# EAGLE design Video_critter_v01 (EAGLE 6.1)
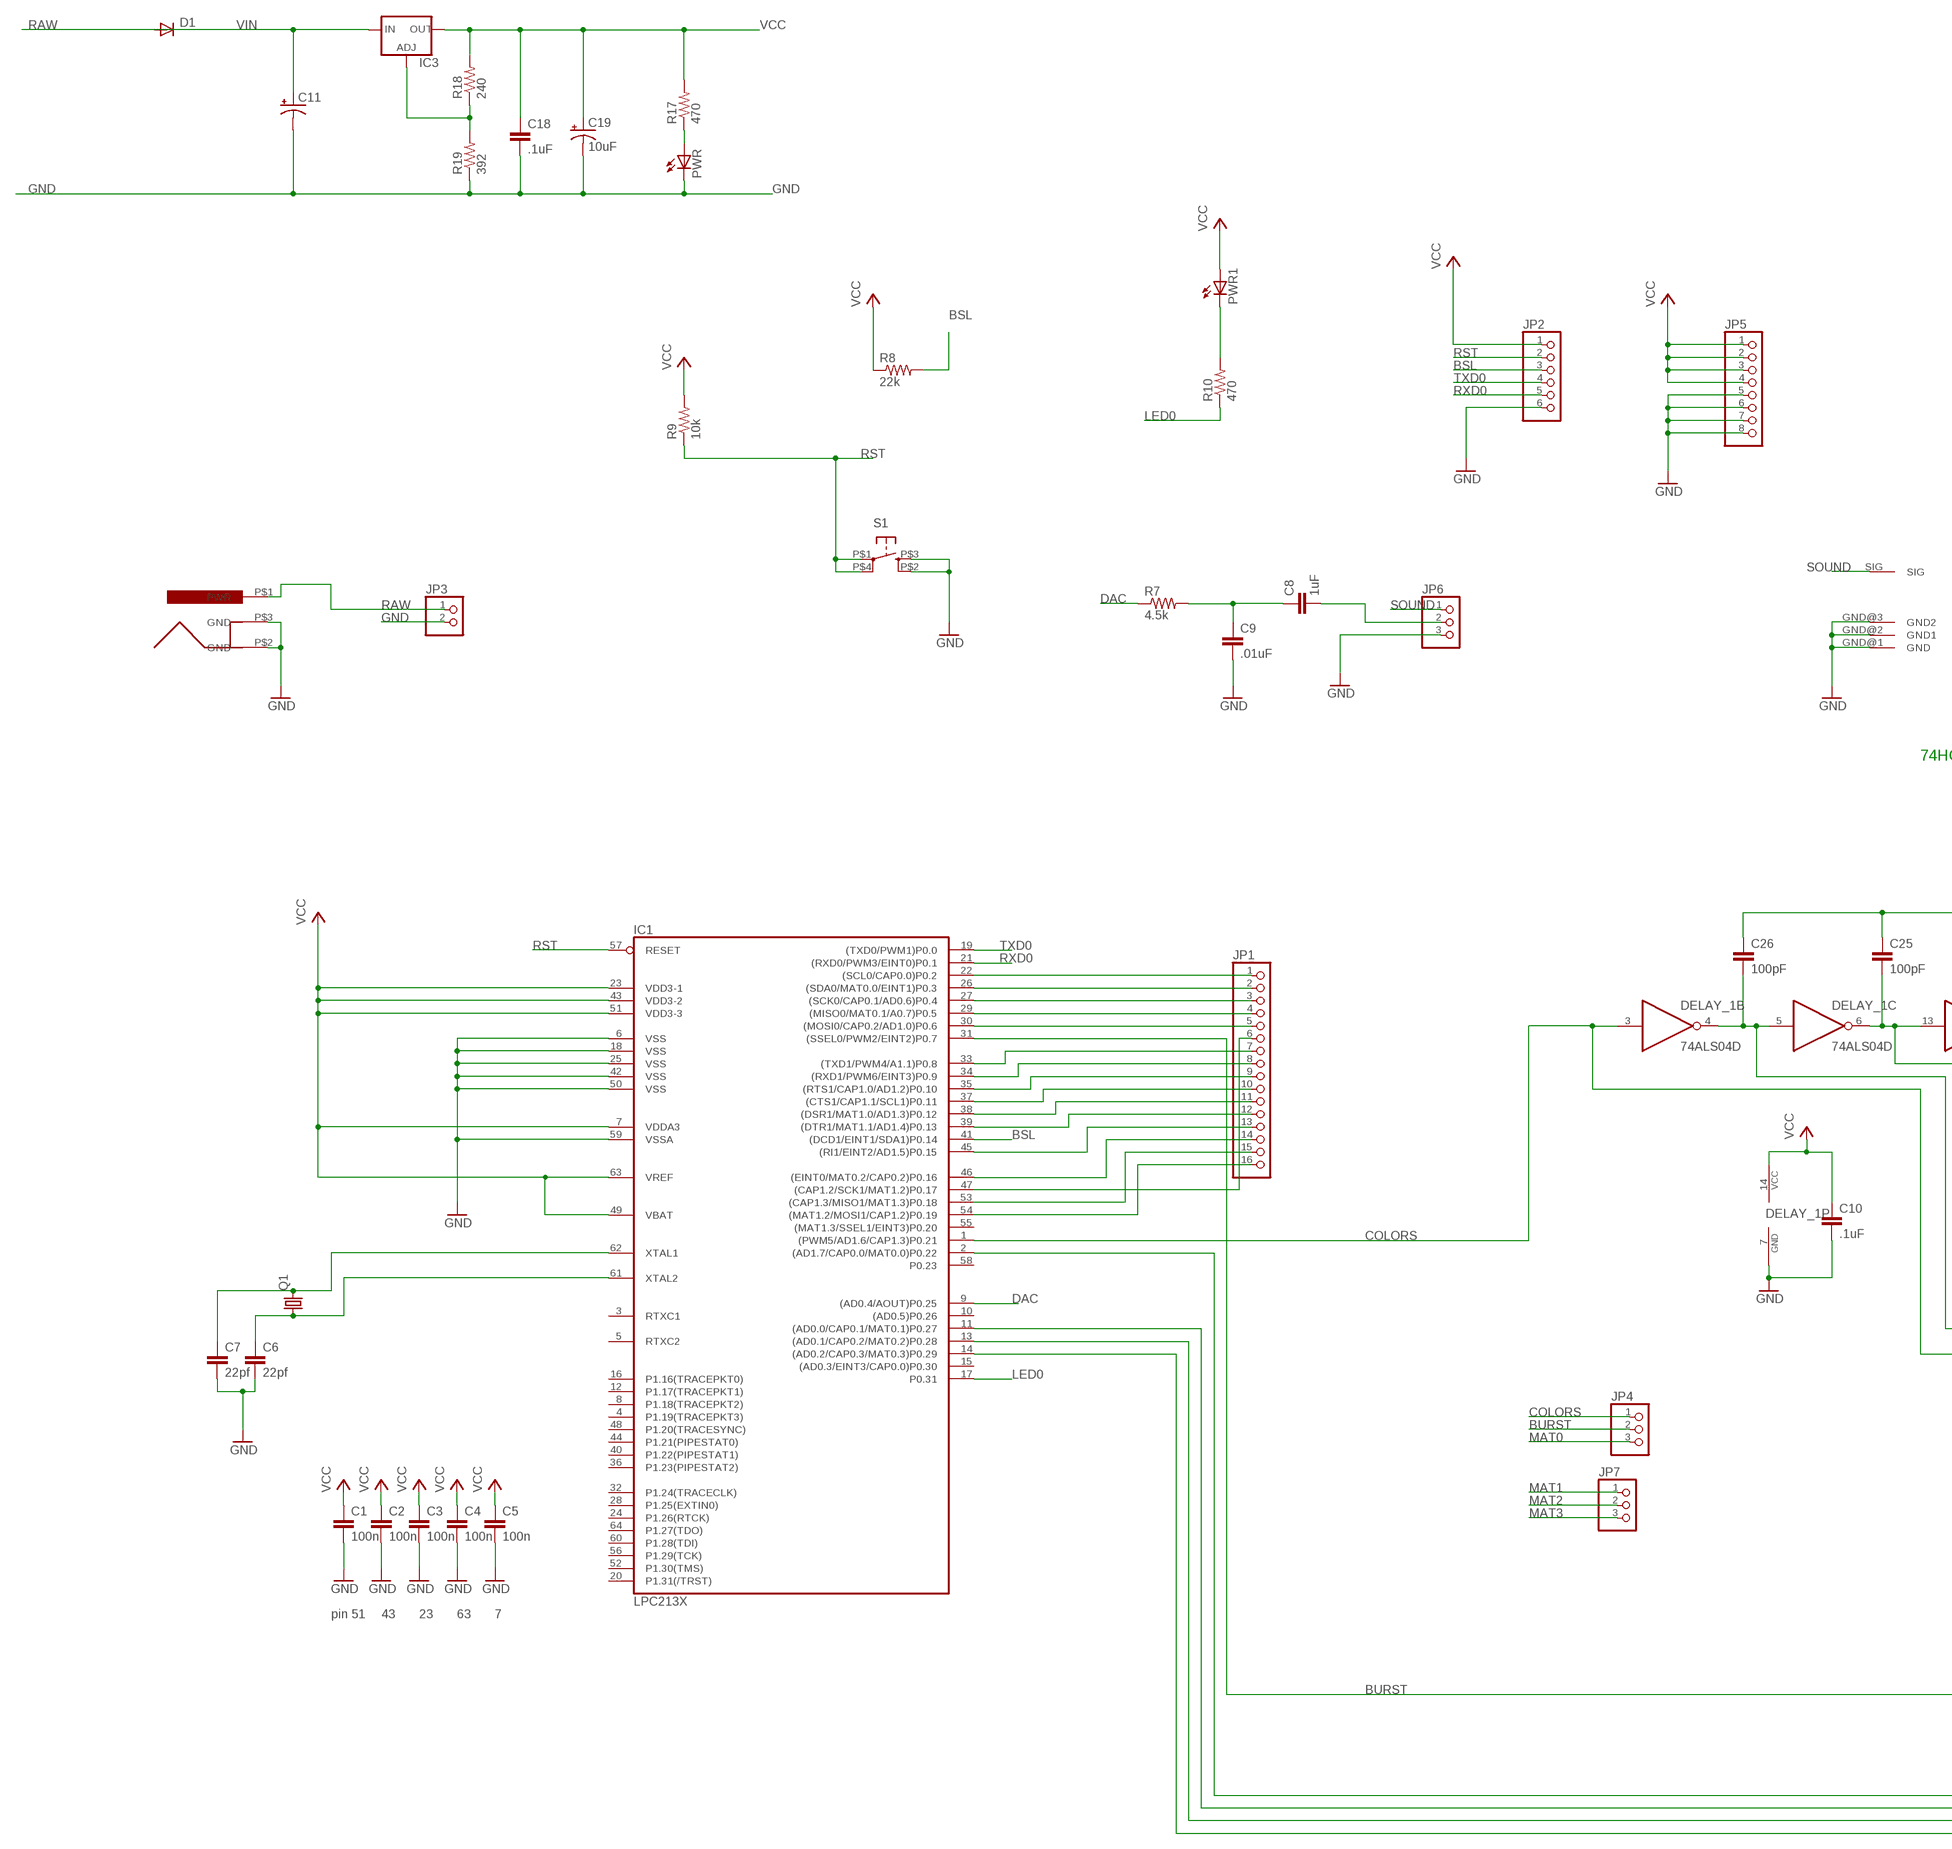
[diagram p0: schematic, sheet 1, part 1 of 2]
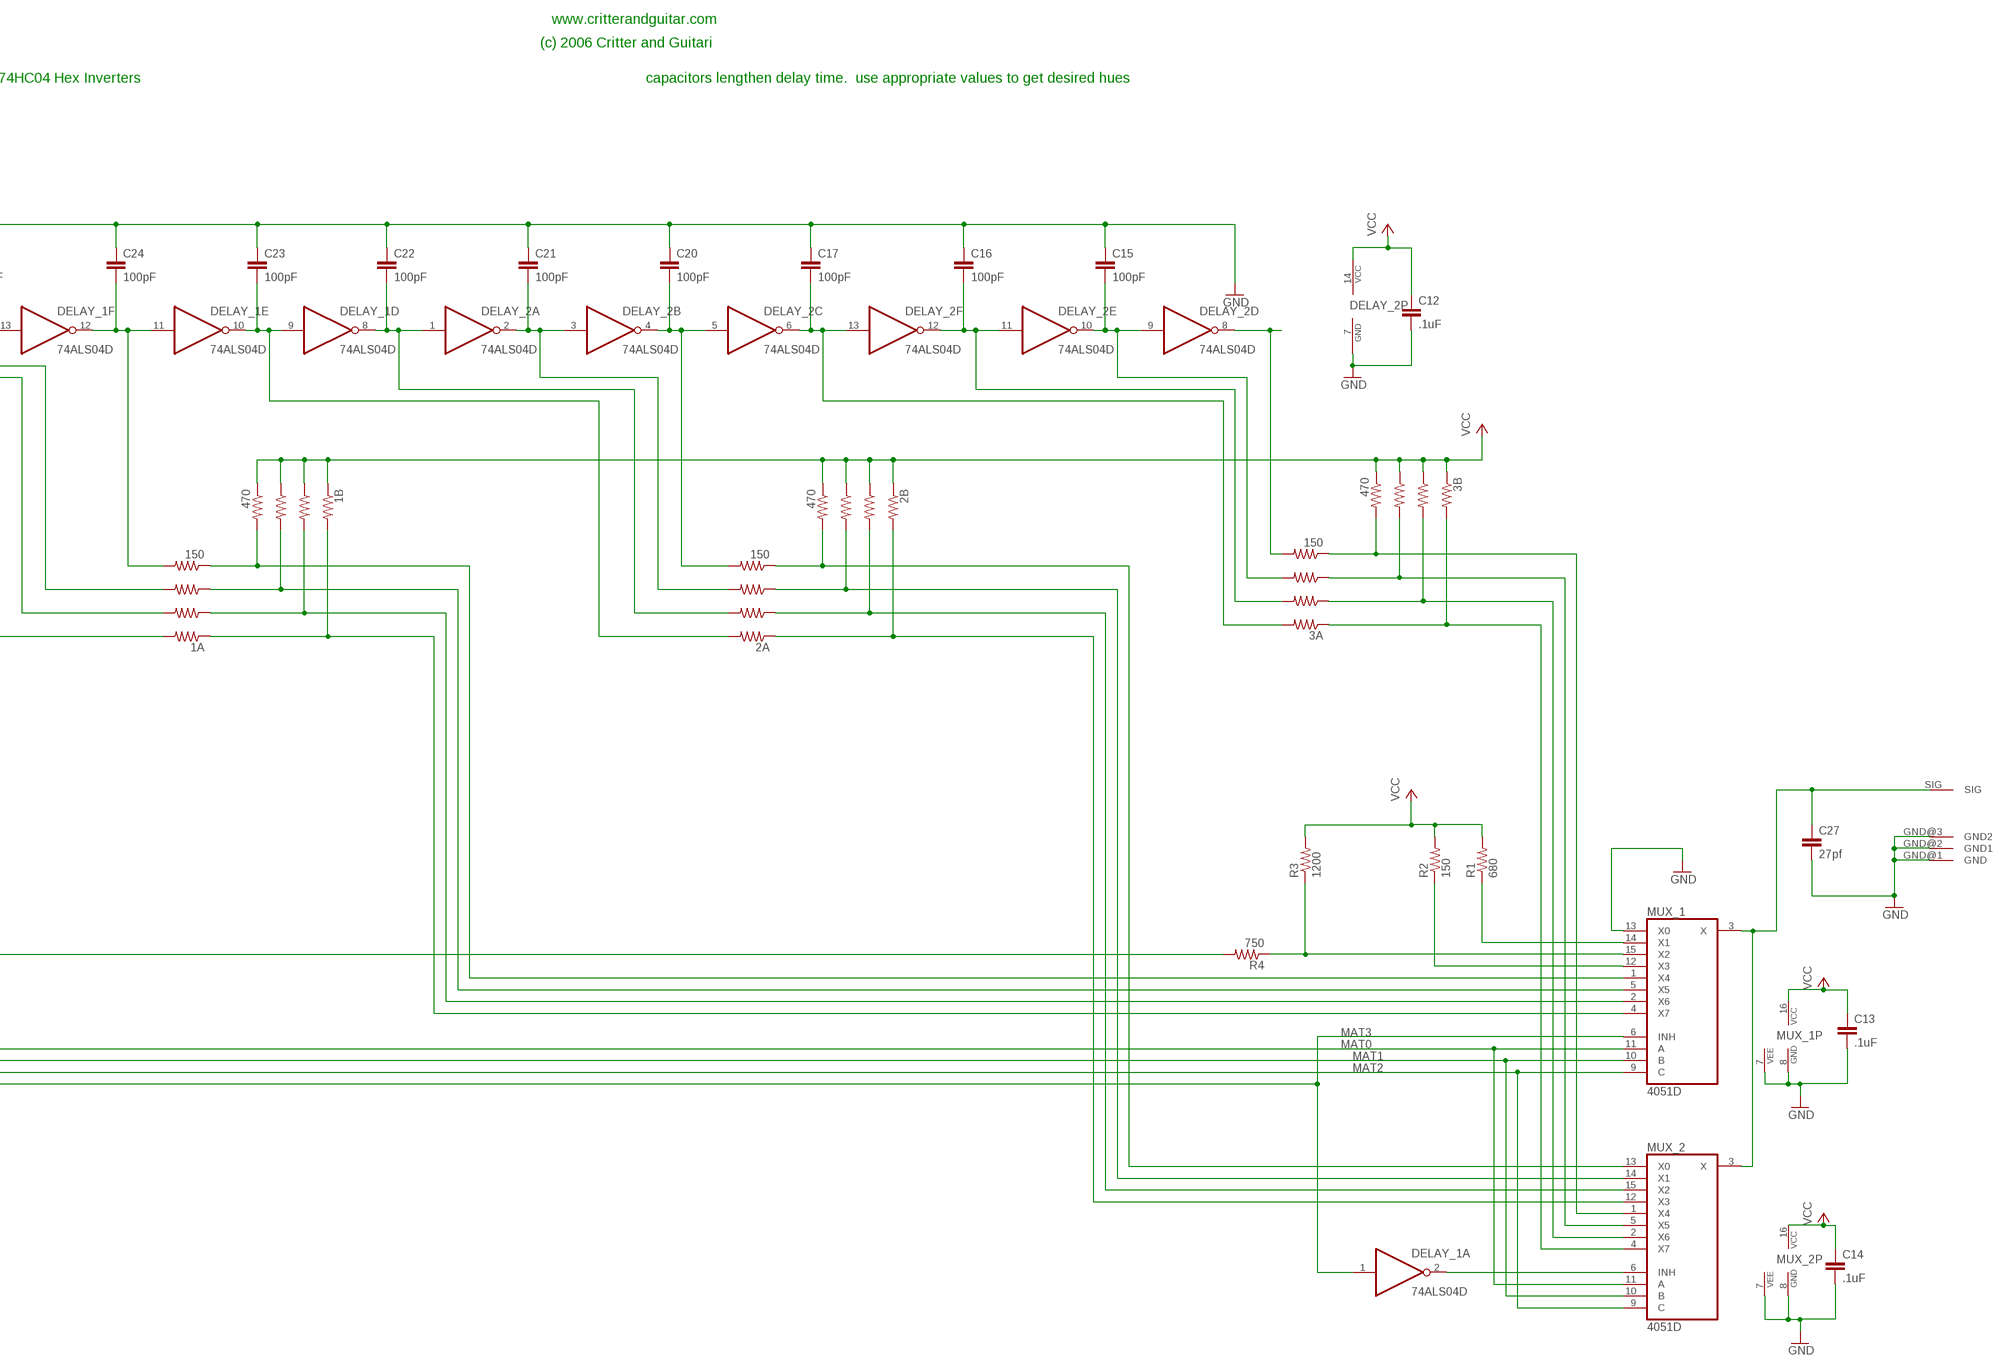
[diagram p1: schematic, sheet 1, part 2 of 2]

## Parts
1A  150  RESISTORX41206  [1206X4RESISTOR]
1B  470  RESISTORX41206  [1206X4RESISTOR]
2A  150  RESISTORX41206  [1206X4RESISTOR]
2B  470  RESISTORX41206  [1206X4RESISTOR]
3A  150  RESISTORX41206  [1206X4RESISTOR]
3B  470  RESISTORX41206  [1206X4RESISTOR]
C1  100n  CAP0603  [C0603]
C2  100n  CAP0603  [C0603]
C3  100n  CAP0603  [C0603]
C4  100n  CAP0603  [C0603]
C5  100n  CAP0603  [C0603]
C6  22pf  CAP0603  [C0603]
C7  22pf  CAP0603  [C0603]
C8  1uF  CAP0603  [C0603]
C9  .01uF  CAP0603  [C0603]
C10  .1uF  CAP0603  [C0603]
C11  CPOL-USE3.5-8  [E3,5-8]
C12  .1uF  CAP0603  [C0603]
C13  .1uF  CAP0603  [C0603]
C14  .1uF  CAP0603  [C0603]
C15  100pF  CAP0603  [C0603]
C16  100pF  CAP0603  [C0603]
C17  100pF  CAP0603  [C0603]
C18  .1uF  CAP0603  [C0603]
C19  10uF  CAP_POL1206  [CPOL_1206]
C20  100pF  CAP0603  [C0603]
C21  100pF  CAP0603  [C0603]
C22  100pF  CAP0603  [C0603]
C23  100pF  CAP0603  [C0603]
C24  100pF  CAP0603  [C0603]
C25  100pF  CAP0603  [C0603]
C26  100pF  CAP0603  [C0603]
C27  27pf  CAP0603  [C0603]
D1  DIODESMB  [SMB]
DELAY_1  74ALS04D  [SO14]
DELAY_2  74ALS04D  [SO14]
IC1  LPC213X  [SQFP-S-10X10-64]
IC3  V_REG_FAN1117SOT223  [SOT223]
JP1  PINHD-1X16  [1X16]
JP2  PINHD-1X6  [1X06]
JP3  PINHD-1X2  [1X02]
JP4  PINHD-1X3  [1X03]
JP5  PINHD-1X8  [1X08]
JP6  PINHD-1X3  [1X03]
JP7  PINHD-1X3  [1X03]
MUX_1  4051D  [SO16]
MUX_2  4051D  [SO16]
PWR  LED1206  [CHIPLED_1206]
PWR1  LED1206  [CHIPLED_1206]
Q1  CRYSTALSOCKETED  [HC49U-SOCKETED]
R1  680  RES0603  [R0603]
R2  150  RES0603  [R0603]
R3  1200  RES0603  [R0603]
R4  750  RES0603  [R0603]
R7  4.5k  RES0603  [R0603]
R8  22k  RES0603  [R0603]
R9  10k  RES0603  [R0603]
R10  470  RES0603  [R0603]
R17  470  RES0603  [R0603]
R18  240  RES0603  [R0603]
R19  392  RES0603  [R0603]
S1  TAC_SWITCH  [TACTILE_SWITCH_SMD]
U$1  POWER_JACK  POWER_JACKTHRU-HOLE  [POWER_JACK]
U$5  PHONO_PLUG  [PHONO_PCB]
U$6  PHONO_PLUG  [PHONO_PCB]

## Nets
3B: 3A.P$5 3B.P$6 MUX_2.2(X6)
BSL: IC1.41((DCD1/EINT1/SDA1)P0.14) JP2.3 R8.2
BURST: IC1.31((SSEL0/PWM2/EINT2)P0.7) JP4.2 R4.2
COLORS: 1A.P$8 DELAY_1.3(B:I) IC1.1((PWM5/AD1.6/CAP1.3)P0.21) JP4.1
DAC: IC1.9((AD0.4/AOUT)P0.25) R7.1
GND [power]: C1.2 C2.2 C3.2 C4.2 C5.2 C6.2 C7.2 C9.2 C10.2 C11.- C12.2 C13.2 C14.2 C15.1 C16.1 C17.1 C18.2 C19.C(-) C20.1 C21.1 C22.1 C23.1 C24.1 C25.1 C26.1 C27.2 DELAY_1.7(P:GND) DELAY_2.7(P:GND) IC1.6(VSS) IC1.18(VSS) IC1.25(VSS) IC1.42(VSS) IC1.50(VSS) IC1.59(VSSA) JP2.6 JP3.2 JP5.5 JP5.6 JP5.7 JP5.8 JP6.3 MUX_1.7(VEE) MUX_1.8(GND) MUX_1.13(X0) MUX_2.7(VEE) MUX_2.8(GND) PWR.C R19.1 S1.P$2(S1) S1.P$3(S) U$1.P$2(GND) U$1.P$3(GND) U$5.GND@1(GND) U$5.GND@2(GND1) U$5.GND@3(GND2) U$6.GND@1(GND) U$6.GND@2(GND1) U$6.GND@3(GND2)
LED0: IC1.17(P0.31) R10.1
MAT0: IC1.2((AD1.7/CAP0.0/MAT0.0)P0.22) JP4.3 MUX_1.11(A) MUX_2.11(A)
MAT1: IC1.11((AD0.0/CAP0.1/MAT0.1)P0.27) JP7.1 MUX_1.10(B) MUX_2.10(B)
MAT2: IC1.13((AD0.1/CAP0.2/MAT0.2)P0.28) JP7.2 MUX_1.9(C) MUX_2.9(C)
MAT3: DELAY_1.1(A:I) IC1.14((AD0.2/CAP0.3/MAT0.3)P0.29) JP7.3 MUX_1.6(INH)
N$1: C8.1 C9.1 R7.2
N$2: C7.1 IC1.62(XTAL1) Q1.2
N$3: C6.1 IC1.61(XTAL2) Q1.1
N$4: PWR1.C R10.2
N$5: IC1.47((CAP1.2/SCK1/MAT1.2)P0.17) JP1.6
N$6: IC1.22((SCL0/CAP0.0)P0.2) JP1.1
N$7: C8.2 JP6.2
N$8: 1A.P$6 C26.2 DELAY_1.4(B:O) DELAY_1.5(C:I)
N$9: IC1.26((SDA0/MAT0.0/EINT1)P0.3) JP1.2
N$10: IC1.27((SCK0/CAP0.1/AD0.6)P0.4) JP1.3
N$11: IC3.1(ADJ) R18.1 R19.2
N$12: IC1.29((MISO0/MAT0.1/A0.7)P0.5) JP1.4
N$13: IC1.30((MOSI0/CAP0.2/AD1.0)P0.6) JP1.5
N$15: IC1.33((TXD1/PWM4/A1.1)P0.8) JP1.7
N$16: IC1.34((RXD1/PWM6/EINT3)P0.9) JP1.8
N$17: IC1.35((RTS1/CAP1.0/AD1.2)P0.10) JP1.9
N$18: IC1.37((CTS1/CAP1.1/SCL1)P0.11) JP1.10
N$19: IC1.38((DSR1/MAT1.0/AD1.3)P0.12) JP1.11
N$20: IC1.39((DTR1/MAT1.1/AD1.4)P0.13) JP1.12
N$21: IC1.45((RI1/EINT2/AD1.5)P0.15) JP1.13
N$22: IC1.46((EINT0/MAT0.2/CAP0.2)P0.16) JP1.14
N$23: IC1.53((CAP1.3/MISO1/MAT1.3)P0.18) JP1.15
N$24: PWR.A R17.1
N$25: IC1.54((MAT1.2/MOSI1/CAP1.2)P0.19) JP1.16
N$31: 1A.P$4 C25.2 DELAY_1.6(C:O) DELAY_1.13(F:I)
N$32: 1A.P$2 C24.2 DELAY_1.11(E:I) DELAY_1.12(F:O)
N$33: 2A.P$8 C23.2 DELAY_1.9(D:I) DELAY_1.10(E:O)
N$34: 2A.P$6 C22.2 DELAY_1.8(D:O) DELAY_2.1(A:I)
N$35: 2A.P$4 C21.2 DELAY_2.2(A:O) DELAY_2.3(B:I)
N$36: 2A.P$2 C20.2 DELAY_2.4(B:O) DELAY_2.5(C:I)
N$37: 3A.P$8 C17.2 DELAY_2.6(C:O) DELAY_2.13(F:I)
N$38: 3A.P$6 C16.2 DELAY_2.11(E:I) DELAY_2.12(F:O)
N$39: 3A.P$4 C15.2 DELAY_2.9(D:I) DELAY_2.10(E:O)
N$40: 3A.P$2 DELAY_2.8(D:O)
N$41: 1A.P$1 1B.P$2 MUX_1.1(X4)
N$42: 1A.P$3 1B.P$4 MUX_1.5(X5)
N$43: 1A.P$5 1B.P$6 MUX_1.2(X6)
N$44: 1A.P$7 1B.P$8 MUX_1.4(X7)
N$45: 2A.P$1 2B.P$2 MUX_2.13(X0)
N$46: 2A.P$3 2B.P$4 MUX_2.14(X1)
N$47: 2A.P$5 2B.P$6 MUX_2.15(X2)
N$48: 2A.P$7 2B.P$8 MUX_2.12(X3)
N$49: 3A.P$1 3B.P$2 MUX_2.1(X4)
N$50: 3A.P$3 3B.P$4 MUX_2.5(X5)
N$51: C27.1 MUX_1.3(X) MUX_2.3(X) U$6.SIG
N$52: 3A.P$7 3B.P$8 MUX_2.4(X7)
N$53: DELAY_1.2(A:O) MUX_2.6(INH)
N$55: MUX_1.15(X2) R3.1 R4.1
N$56: MUX_1.12(X3) R2.1
N$57: MUX_1.14(X1) R1.1
RAW: D1.1(C) JP3.1 U$1.P$1(PWR)
RST: IC1.57(RESET) JP2.2 R9.1 S1.P$1(P) S1.P$4(P1)
RXD0: IC1.21((RXD0/PWM3/EINT0)P0.1) JP2.5
SOUND: JP6.1 U$5.SIG
TXD0: IC1.19((TXD0/PWM1)P0.0) JP2.4
VCC [power]: 1B.P$1 1B.P$3 1B.P$5 1B.P$7 2B.P$1 2B.P$3 2B.P$5 2B.P$7 3B.P$1 3B.P$3 3B.P$5 3B.P$7 C1.1 C2.1 C3.1 C4.1 C5.1 C10.1 C12.1 C13.1 C14.1 C18.1 C19.A(+) DELAY_1.14(P:VCC) DELAY_2.14(P:VCC) IC1.7(VDDA3) IC1.23(VDD3-1) IC1.43(VDD3-2) IC1.49(VBAT) IC1.51(VDD3-3) IC1.63(VREF) IC3.2(OUT) JP2.1 JP5.1 JP5.2 JP5.3 JP5.4 MUX_1.16(VCC) MUX_2.16(VCC) PWR1.A R1.2 R2.2 R3.2 R8.1 R9.2 R17.2 R18.2
VIN [power]: C11.+ D1.2(A) IC3.3(IN)
Unconnected: IC1.3(RTXC1) IC1.4(P1.19(TRACEPKT3)) IC1.5(RTXC2) IC1.8(P1.18(TRACEPKT2)) IC1.10((AD0.5)P0.26) IC1.12(P1.17(TRACEPKT1)) IC1.15((AD0.3/EINT3/CAP0.0)P0.30) IC1.16(P1.16(TRACEPKT0)) IC1.20(P1.31(/TRST)) IC1.24(P1.26(RTCK)) IC1.28(P1.25(EXTIN0)) IC1.32(P1.24(TRACECLK)) IC1.36(P1.23(PIPESTAT2)) IC1.40(P1.22(PIPESTAT1)) IC1.44(P1.21(PIPESTAT0)) IC1.48(P1.20(TRACESYNC)) IC1.52(P1.30(TMS)) IC1.55((MAT1.3/SSEL1/EINT3)P0.20) IC1.56(P1.29(TCK)) IC1.58(P0.23) IC1.60(P1.28(TDI)) IC1.64(P1.27(TDO))

## Notes on the sheet
- www.critterandguitar.com
- (c) 2006 Critter and Guitari
- 74HC04 Hex Inverters | capacitors lengthen delay time.  use appropriate values to get desired hues
- pin 51 | 43 | 23 | 63 | 7

## Library data of the parts
1A 1B 2A 2B 3A 3B = SparkFun:RESISTORX4
C1-C10 C12-C18 C20-C27 = SparkFun:CAP: CAPACITOR
C11 = rcl:CPOL-US: POLARIZED CAPACITOR, American symbol
C19 = SparkFun:CAP_POL
D1 = SparkFun:DIODE
DELAY_1 DELAY_2 = 74xx-us:74*04: Hex INVERTER
IC1 = SparkFun:LPC213X
IC3 = SparkFun:V_REG_FAN1117: VOLTAGE REGULATOR
JP1 = pinhead:PINHD-1X16: PIN HEADER
JP2 = pinhead:PINHD-1X6: PIN HEADER
JP3 = pinhead:PINHD-1X2: PIN HEADER
JP4 JP6 JP7 = pinhead:PINHD-1X3: PIN HEADER
JP5 = pinhead:PINHD-1X8: PIN HEADER
MUX_1 MUX_2 = 40xx:4051: 8-channel ANALOG MULTIPLEXER
PWR PWR1 = SparkFun:LED
Q1 = SparkFun:CRYSTAL
R1-R4 R7-R10 R17-R19 = SparkFun:RES: RESISTOR
S1 = SparkFun:TAC_SWITCH: OMRON SWITCH
U$1 = SparkFun:POWER_JACK
U$5 U$6 = sfe_owen:PHONO_PLUG

## Net classes
0 default: width 0.254 mm
1 power: width 0.254 mm

## Board
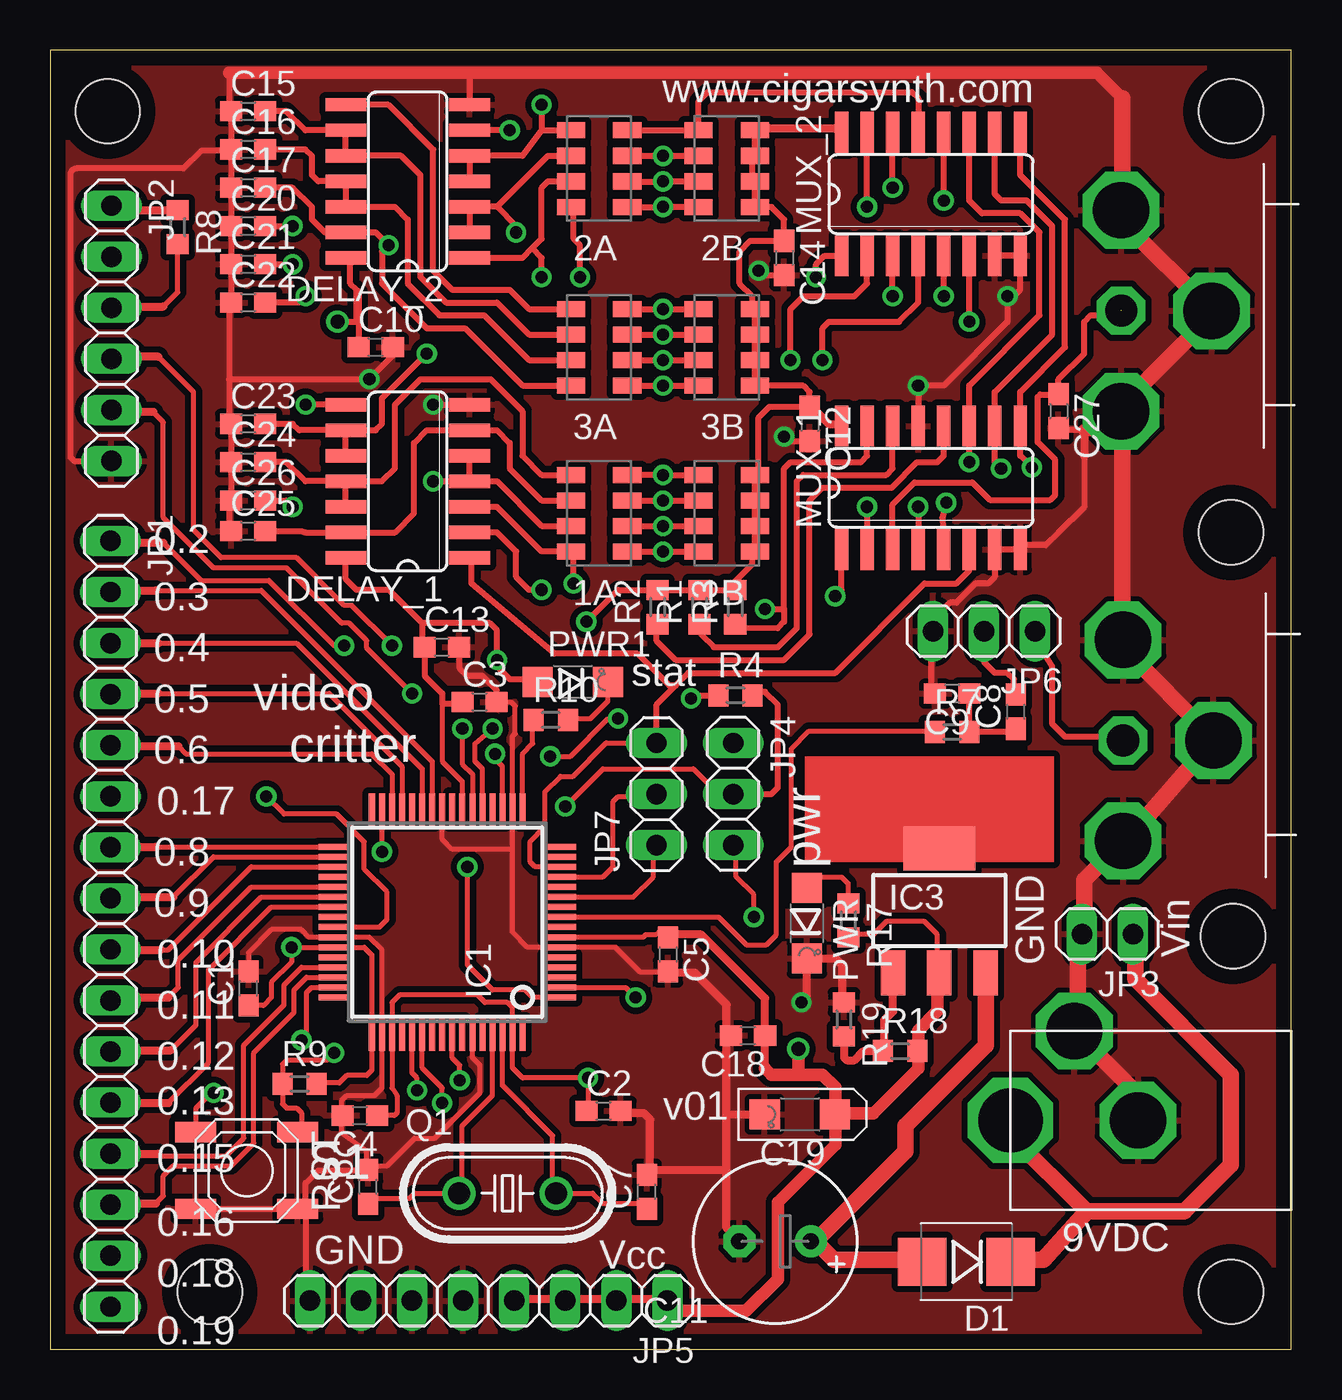
[diagram p2: board, top side]
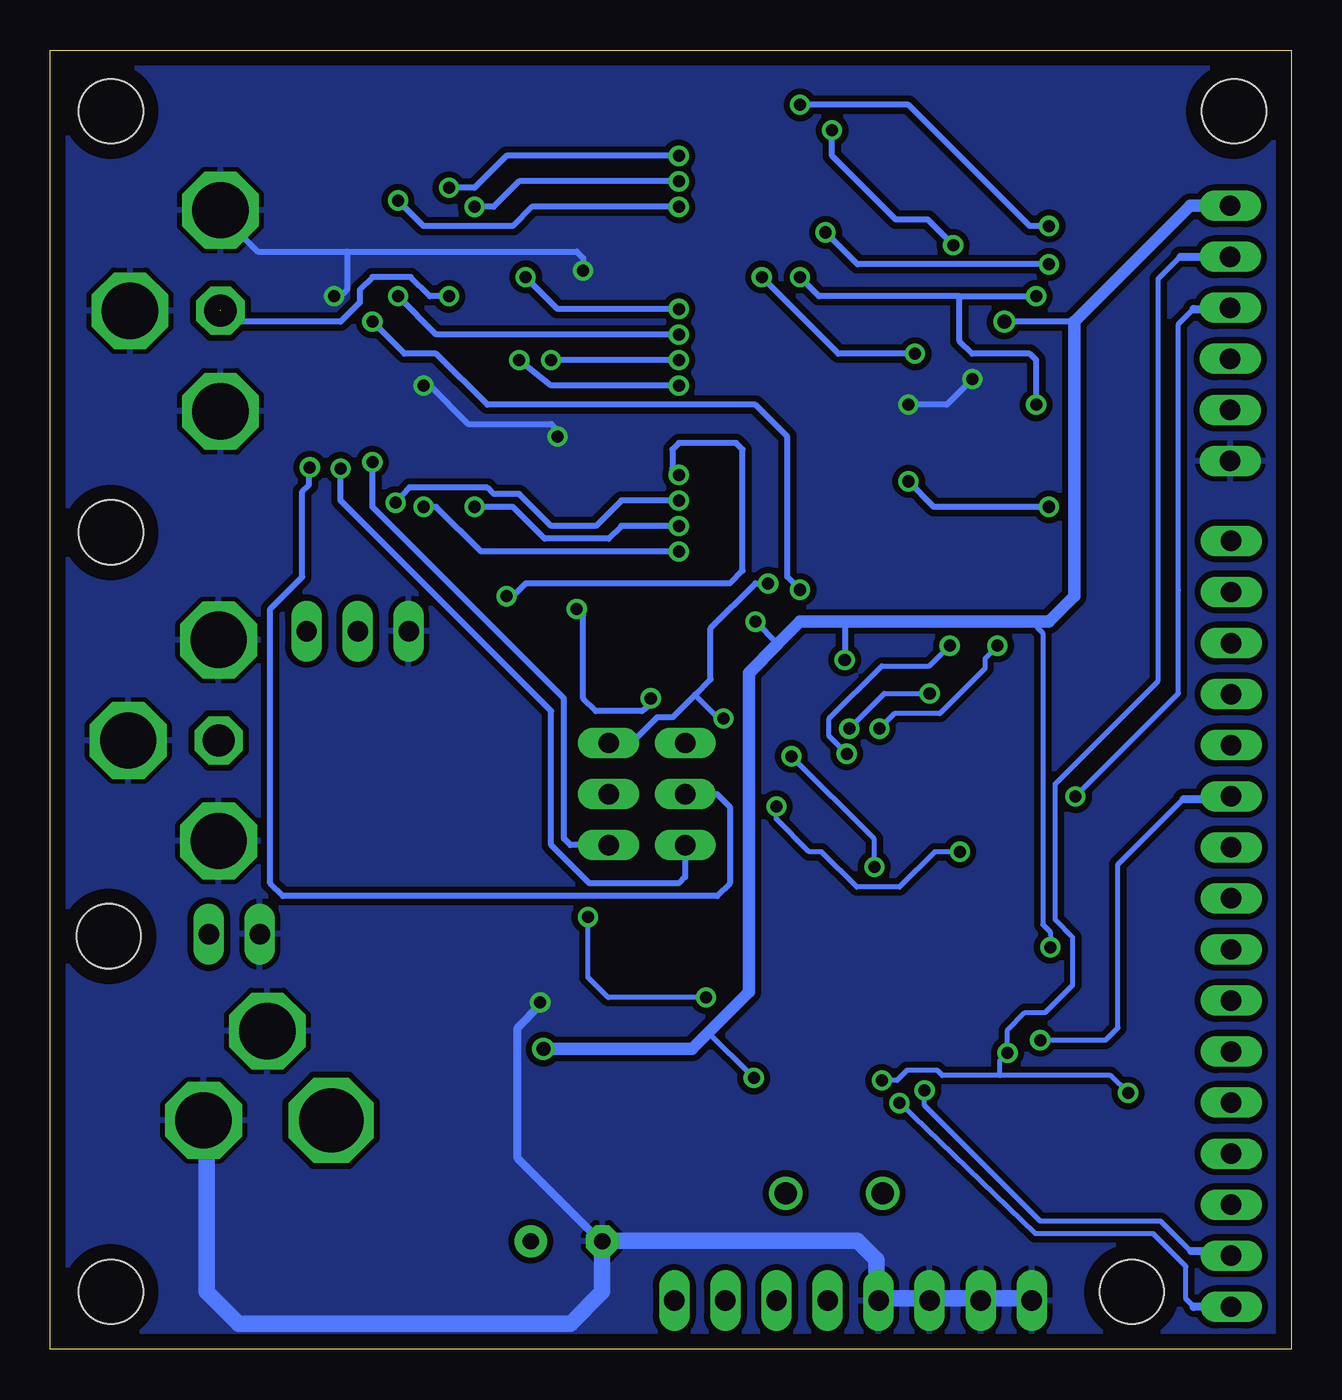
[diagram p3: board, bottom side, seen from below]

Size 61.75 x 64.62 mm. Coordinates in mm from the lower left corner, seen from the top.
Outline: 0,0 61.75,0 61.75,64.62 0,64.62 0,0
Copper layers (1*16): Top 0.035mm / dielectric 1.5mm / Bottom 0.035mm
Design rules: minimum track width 10mil, minimum drill 20mil, track to track 8mil, track to pad 8mil, pad to pad 8mil, via to via 8mil, smd to smd 8mil, copper to edge 30mil, drill to drill 8mil, minimum pad ring 10mil, minimum via ring 8mil, stop-mask expansion 4mil, vias tented up to drill 0mil, thermal gap 10mil
Holes 3.2 mm at 58.74,2.86 58.74,40.64 58.84,20.55 58.74,61.59 2.86,61.59 7.94,2.86

### Footprints (pad centres in the part's own frame; a part is rotated, then mirrored left to right if it is on the bottom)
1206X4RESISTOR = smd 1.4 x 0.8: P$1 -1.4,-1.9; P$2 1.4,-1.9; P$3 -1.4,-0.63; P$4 1.4,-0.63; P$5 -1.4,0.64; P$6 1.4,0.64; P$7 -1.4,1.91; P$8 1.4,1.91
C0603 = smd 1.1 x 1: 1 -0.85,0; 2 0.85,0
E3,5-8 = drill 0.813 pad 1.6: + -1.778,0 | drill 0.813 pad 1.6 octagon: - 1.778,0
CPOL_1206 = smd 1.5 x 1.5: A 0,-1.75; C 0,1.75
SMB = smd 2.4 x 2.4: 1 -2.2,0; 2 2.2,0
SO14 = smd 0.66 x 2.032: 1 -3.81,-3.073; 2 -2.54,-3.073; 3 -1.27,-3.073; 4 0,-3.073; 5 1.27,-3.073; 6 2.54,-3.073; 7 3.81,-3.073; 8 3.81,3.073; 9 2.54,3.073; 10 1.27,3.073; 11 0,3.073; 12 -1.27,3.073; 13 -2.54,3.073; 14 -3.81,3.073
SQFP-S-10X10-64 = smd 0.3 x 1.6: 1 -3.75,-5.6; 2 -3.25,-5.6; 3 -2.75,-5.6; 4 -2.25,-5.6; 5 -1.75,-5.6; 6 -1.25,-5.6; 7 -0.75,-5.6; 8 -0.25,-5.6; 9 0.25,-5.6; 10 0.75,-5.6; 11 1.25,-5.6; 12 1.75,-5.6; 13 2.25,-5.6; 14 2.75,-5.6; 15 3.25,-5.6; 16 3.75,-5.6; 33 3.75,5.6; 34 3.25,5.6; 35 2.75,5.6; 36 2.25,5.6; 37 1.75,5.6; 38 1.25,5.6; 39 0.75,5.6; 40 0.25,5.6; 41 -0.25,5.6; 42 -0.75,5.6; 43 -1.25,5.6; 44 -1.75,5.6; 45 -2.25,5.6; 46 -2.75,5.6; 47 -3.25,5.6; 48 -3.75,5.6 | smd 1.6 x 0.3: 17 5.6,-3.75; 18 5.6,-3.25; 19 5.6,-2.75; 20 5.6,-2.25; 21 5.6,-1.75; 22 5.6,-1.25; 23 5.6,-0.75; 24 5.6,-0.25; 25 5.6,0.25; 26 5.6,0.75; 27 5.6,1.25; 28 5.6,1.75; 29 5.6,2.25; 30 5.6,2.75; 31 5.6,3.25; 32 5.6,3.75; 49 -5.6,3.75; 50 -5.6,3.25; 51 -5.6,2.75; 52 -5.6,2.25; 53 -5.6,1.75; 54 -5.6,1.25; 55 -5.6,0.75; 56 -5.6,0.25; 57 -5.6,-0.25; 58 -5.6,-0.75; 59 -5.6,-1.25; 60 -5.6,-1.75; 61 -5.6,-2.25; 62 -5.6,-2.75; 63 -5.6,-3.25; 64 -5.6,-3.75
SOT223 = smd 1.219 x 2.235: 1 -2.311,-3.099; 2 0,-3.099; 3 2.311,-3.099 | smd 3.6 x 2.2: 4 0,3.099
1X16 = drill 1.016 long: 1 -19.05,0; 2 -16.51,0; 3 -13.97,0; 4 -11.43,0; 5 -8.89,0; 6 -6.35,0; 7 -3.81,0; 8 -1.27,0; 9 1.27,0; 10 3.81,0; 11 6.35,0; 12 8.89,0; 13 11.43,0; 14 13.97,0; 15 16.51,0; 16 19.05,0
1X06 = drill 1.016 long: 1 -6.35,0; 2 -3.81,0; 3 -1.27,0; 4 1.27,0; 5 3.81,0; 6 6.35,0
1X02 = drill 1.016 long: 1 -1.27,0; 2 1.27,0
1X03 = drill 1.016 long: 1 -2.54,0; 2 0,0; 3 2.54,0
1X08 = drill 1.016 long: 1 -8.89,0; 2 -6.35,0; 3 -3.81,0; 4 -1.27,0; 5 1.27,0; 6 3.81,0; 7 6.35,0; 8 8.89,0
SO16 = smd 0.66 x 2.032: 1 -4.445,-3.073; 2 -3.175,-3.073; 3 -1.905,-3.073; 4 -0.635,-3.073; 5 0.635,-3.073; 6 1.905,-3.073; 7 3.175,-3.073; 8 4.445,-3.073; 9 4.445,3.073; 10 3.175,3.073; 11 1.905,3.073; 12 0.635,3.073; 13 -0.635,3.073; 14 -1.905,3.073; 15 -3.175,3.073; 16 -4.445,3.073
CHIPLED_1206 = smd 1.5 x 1.5: A 0,-1.75; C 0,1.75
HC49U-SOCKETED = drill 1.1: 1 -2.413,0; 2 2.413,0
R0603 = smd 1 x 1.1: 1 -0.85,0; 2 0.85,0
TACTILE_SWITCH_SMD = smd 2.032 x 1.016: P$1 -2.54,1.905; P$2 -2.54,-1.905; P$3 2.54,-1.905; P$4 2.54,1.905
POWER_JACK = drill 3.2 octagon: P$1 0,4.445 | drill 2.8 octagon: P$2 3.175,8.89; P$3 6.35,4.445
PHONO_PCB = drill 2.8 octagon: GND@1 0,5; GND@2 0,-5; GND@3 4.5,0 | drill 1.6 octagon: SIG 0,0

### Placement (x,y rotation side)
1A  27.3,41.59 180 top
1B  33.66,41.59 180 top
2A  27.3,58.74 180 top
2B  33.66,58.74 180 top
3A  27.3,49.85 180 top
3B  33.66,49.85 180 top
C1  9.86,17.96 90 top
C2  27.53,11.85 0 top
C3  21.36,32.2 0 top
C4  15.4,11.62 180 top
C5  30.74,19.64 270 top
C6  15.82,8.08 90 top
C7  29.68,7.83 90 top
C8  48.05,31.72 90 top
C9  44.87,32.61 180 top
C10  16.19,49.85 0 top
C11  36.06,5.37 180 top
C12  37.78,46.04 270 top
C13  19.48,34.92 0 top
C14  36.51,54.29 270 top
C15  9.84,61.59 0 top
C16  9.84,59.69 0 top
C17  9.84,57.78 0 top
C18  34.72,15.6 180 top
C19  37.29,11.69 90 top
C20  9.84,55.88 0 top
C21  9.84,53.98 0 top
C22  9.84,52.07 0 top
C23  9.84,46.04 0 top
C24  9.84,44.13 0 top
C25  9.84,40.7 0 top
C26  9.84,42.23 0 top
C27  50.16,46.67 270 top
D1  45.57,4.35 180 top
DELAY_1  17.78,43.18 90 top
DELAY_2  17.78,58.1 90 top
IC1  19.75,21.25 90 top
IC3  44.24,21.82 0 top
JP1  3,21.16 270 top
JP2  3.04,50.54 270 top
JP3  52.59,20.65 180 top
JP4  33.97,27.62 270 top
JP5  21.81,2.42 180 top
JP6  46.46,35.72 180 top
JP7  30.16,27.62 90 top
MUX_1  43.81,42.86 0 top
MUX_2  43.81,57.47 0 top
PWR  37.65,21.19 180 top
PWR1  26,33.19 270 top
Q1  22.75,7.76 0 top
R1  32.31,36.92 90 top
R2  30.22,36.92 90 top
R3  34.08,36.92 90 top
R4  34.09,32.53 0 top
R7  44.87,30.71 0 top
R8  6.34,55.83 270 top
R9  12.4,13.2 0 top
R10  24.9,31.31 0 top
R17  39.71,21.33 270 top
R18  42.28,14.83 0 top
R19  39.49,16.41 270 top
S1  9.78,8.89 0 top
U$1  47.77,6.94 0 top
U$5  53.37,30.29 0 top
U$6  53.28,51.66 0 top

### Tracks (layer width: path | path; a pad name or v marks a point on that pad's centre or on a via)
3B  (via drill 0.6)
  Top 0.305: 3A.P$5 v30.48,49.21 32.07,49.21 3B.P$6 | v36.83,49.21 36.83,51.75 37.47,52.39 40.01,52.39 40.64,53.02 MUX_2.2 40.64,54.61
  Bottom 0.305: v30.48,49.21 v36.83,49.21
BSL  (via drill 0.6)
  Top 0.254: IC1.41 16.38,21 16.75,21.38 16.75,22.75 15.62,23.88 15.62,25.25 14.25,26.62 11.62,26.62 v10.75,27.5 | R8.2 6.34,52.59 5.62,51.88 | 3.04,51.8 2.88,51.62 | JP2.3 3.04,51.8 | 3.04,51.8 3.12,51.88
  Top 0.406: 3.12,51.88 5.62,51.88
  Bottom 0.254: v10.75,27.5 5.62,32.62 5.62,37.75 5.62,51 4.88,51.75 | 3,51.75 3,51.77 JP2.3
  Bottom 0.406: 4.88,51.75 3,51.75
BURST  (via drill 0.6)
  Top 0.254: JP4.2 33.25,27.62 32,28.88 27.5,28.88 v25.62,27 | 16.5,27.12 | 16.5,27.12 IC1.31 | v16.5,24.75 16.5,27.12
  Top 0.305: JP4.2 35.88,27.62 36.2,27.94 36.2,32.07 35.56,32.7 34.92,32.7 34.92,32.55 R4.2
  Bottom 0.254: v25.62,27 25.62,26.38 24,24.75 23.38,24.75 21.62,23 19.5,23 17.75,24.75 v16.5,24.75
COLORS  (via drill 0.6)
  Top 0.254: IC1.1 24,17.5 23.62,17.88 22,17.88 20.75,19.12 v20.75,24 | v24.88,29.5 25.88,29.5 27.75,31.38 v28.25,31.38
  Top 0.305: DELAY_1.3 22.23,41.91 24.45,39.69 25.72,39.69 | 25.72,39.69 26.04,39.69 26.03,39.68 1A.P$8 25.72,39.68 25.72,39.69 | v26.04,38.1 26.04,39.37 25.72,39.69
  Bottom 0.254: v20.75,24 20.75,25.38 v24.88,29.5 | 29.62,32.62 29.68,32.55 28.5,31.38 v28.25,31.38
  Bottom 0.305: JP4.1 32.83,30.16 31.56,31.43 30.8,31.43 29.68,32.55 28.89,33.34 28.89,35.88 26.67,38.1 v26.04,38.1
DAC
  Top 0.254: IC1.9 33.25,21.5 34.62,20.12 35.62,20.12 36.12,20.62 36.12,24.25 36.88,25 36.88,29.88 37.75,30.75 44,30.75 44.02,30.73 R7.1
GND  (via drill 0.6)
  Top 0.254: 23,27 | 23,27 IC1.18 23,30.5 23.12,30.62 23.12,32 22.96,32.17 C3.2 | 23,24.88 23,20.75 23.75,20 25.75,20 | 23,24.88 23,27 | 30.74,18.86 30.75,18.88 | C5.2 30.74,18.86 | 30.74,18.86 30.62,18.75 29.38,18.75 28.12,20 IC1.6 25.75,20 | 25.75,20 | IC1.42 15.88,20.5 16.5,19.88 16.5,15.5 | 16.5,15.5 | 16.5,15.5 IC1.50 | IC1.25 19.5,25.38 20,24.88 23,24.88 | IC1.42 | IC1.42 12.88,20.5 12.5,20.88 11,20.88 9.86,19.74 C1.2 | 16.5,15.5 16.5,13 16.12,12.62 14.75,12.62 14.5,12.38 14.5,11.5 | 14.5,11.5 14.43,11.55 C4.2 | IC1.59 21,14.5 21.38,14.12 21.38,12.75 19.12,10.5 18.12,10.5 16.75,9.12 15.75,9.12 | 15.75,9.12 15.82,9.06 C6.2 15.82,8.94 15.88,9 15.75,9.12 | 14.5,11.5 14.5,10.75 15.75,9.88 15.75,9.12
  Top 0.305: C6.2 15.78,8.89 13.34,8.89 12.7,8.26 12.7,6.99 | 12.7,6.99 12.62,7.07 | 12.7,6.99 S1.P$3 S1.P$2 6.67,6.99 | JP5.8 12.82,2.42 12.7,2.54 12.7,6.99 | DELAY_2.7 20.85,63.4 20.95,63.5 | v19.05,46.99 DELAY_1.7 | 8.89,48.26 v15.88,48.26 17.04,49.43 C10.2 | 8.89,51.75 8.89,48.26 | 8.89,51.75 8.89,52.07 C22.1 8.99,51.85 | 8.89,48.26 8.89,46.04 C23.1 8.99,44.23 8.89,44.13 C24.1 8.99,42.33 8.89,42.23 | 8.89,42.23 C26.1 | C25.1 8.99,40.61 8.89,40.51 8.89,42.23 | 8.89,63.5 8.89,61.59 C15.1 8.99,59.79 8.89,59.69 C16.1 | C16.1 8.99,57.89 8.89,57.78 C17.1 C20.1 | C20.1 8.99,55.66 8.89,55.56 | C20.1 8.99,54.08 8.89,53.98 C21.1 8.99,51.85 | 8.99,51.85 8.89,51.75 | C14.2 35.46,53.44 v35.24,53.66 | MUX_2.7 46.99,54.29 47.09,54.39 MUX_2.8 48.26,52.7 47.94,52.39 v47.62,52.39 47.62,51.12 44.45,47.94 v43.18,47.94 MUX_1.13 | C12.2 36.73,45.19 v36.51,45.4 | C27.2 50.48,45.72 51.44,45.72 51.25,45.75 | 43.81,35.83 43.81,35.88 | 43.81,35.83 JP6.3 43.91,36.09 43.81,36.2 44.77,37.15 45.09,37.15 46.04,38.1 46.67,38.1 46.99,38.42 MUX_1.7 46.99,40.01 47.21,39.79 MUX_1.8 48.26,40.01 49.53,40.01 49.53,40.03 50.16,40.64 51.44,41.91 51.44,44.45 | C9.2 43.81,32.82 43.81,35.83 | C3.2 22.21,32.79 21.5,33.5 20.75,33.5 20.38,33.88 20.33,35.04 C13.2 | JP2.6 1.18,44.19 1,44.38 1,58.43 arc-90 1.32,58.75 6.62,58.75 7.5,59.62 8.75,59.62 8.88,59.75 8.94,59.69 C16.1
  Top 0.406: C5.2 30.8,18.73 32.07,18.73 33.66,17.14 33.66,15.56 33.82,15.56 C18.2 33.66,15.39 33.66,11.75 | C11.- 34.28,5.39 34.29,5.4 33.66,6.03 33.66,8.89 | 33.66,8.89 33.66,11.75 | C19.C 33.71,11.69 33.66,11.75 | 33.66,8.89 29.89,8.89 C7.2 29.84,8.84 29.84,11.43 29.53,11.75 28.48,11.75 C2.2 | 39.49,17.14 39.62,17 | 39.49,17.14 R19.1 | 39.49,17.14 39.38,17.25 39.38,19.12 39.05,19.45 PWR.C 37.65,17.52 v37.38,17.25 | 51.44,45.72 51.44,44.45
  Top 0.61: 53.34,62.23 52.07,63.5 20.95,63.5 8.89,63.5 | 53.34,45.72 51.44,45.72
  Top 0.813: U$1.P$3 54.08,11.43 53.98,11.43 53.98,12.8 U$1.P$2 50.99,15.88 51.12,15.88 51.12,20.45 JP3.2 51.34,20.64 51.44,20.64 51.44,23.35 U$5.GND@2 53.34,25.08 U$5.GND@3 57.88,30.39 53.38,34.89 U$5.GND@1 53.34,35.32 53.34,45.72 53.34,46.73 | 53.34,46.73 53.34,46.99 57.78,51.44 U$6.GND@3 | 53.34,46.73 U$6.GND@2 | U$6.GND@3 57.78,51.75 | U$6.GND@3 53.34,56.1 53.34,56.73 | 53.34,56.73 53.34,56.83 | 53.34,56.73 U$6.GND@1 | 53.34,56.73 53.34,62.23
  Bottom 0.305: v19.05,46.99 17.14,46.99 v15.88,48.26 | v35.24,53.66 35.24,54.29 35.56,54.61 46.99,54.61 | U$6.GND@1 53.28,56.58 53.34,56.52 51.44,54.61 46.99,54.61 | 46.99,54.61 46.99,52.7 47.31,52.39 v47.62,52.39 | v36.51,45.4 36.51,45.72 36.83,46.04 40.96,46.04 42.86,47.94 v43.18,47.94
  Bottom 0.406: v37.38,17.25 37.38,17.12 38.5,16 38.5,9.5 34.28,5.28 | 34.28,5.28 34.25,5.25 | C11.- 34.28,5.28
  Bottom 0.813: U$1.P$3 54.08,11.43 53.98,11.43 53.98,2.86 52.39,1.27 35.88,1.27 34.29,2.86 C11.- 34.29,5.4 21.59,5.4 20.64,4.45 20.64,2.52 JP5.5 20.42,2.54 17.88,2.54 | 17.88,2.54 17.78,2.54 | 17.88,2.54 JP5.6 | 17.88,2.54 15.56,2.54 15.56,2.52 JP5.7 15.34,2.54 13.02,2.54 13.02,2.52 JP5.8
  pour Top (isolate 0.305): -1.25,66.75 64.75,66.75 64.75,-2.5 -1.25,-2.5
  pour Bottom (isolate 0.305): -1.75,66.75 64.88,66.75 64.88,-3.25 -1.75,-3.25
LED0
  Top 0.254: IC1.17 23.5,29.62 24,30.12 24,31.25 R10.1
MAT0  (via drill 0.6)
  Top 0.254: IC1.2 28.62,18 v29.12,17.5 | v35,21.5 35,22.62 34.12,23.5 34.12,24.88 33.97,25.03 JP4.3
  Top 0.305: MUX_2.11 45.72,57.15 46.35,56.52 48.26,56.52 49.21,55.56 49.21,51.44 45.72,47.94 MUX_1.11 v45.72,44.13
  Bottom 0.254: v29.12,17.5 34,17.5 35,18.5 v35,21.5
  Bottom 0.305: v45.72,44.13 45.72,41.91 36.2,32.38 36.2,25.4 35.88,25.08 JP4.3
MAT1  (via drill 0.6)
  Top 0.254: IC1.11 29,22.5 30,23.5 30,24.75 30.25,25 JP7.1
  Top 0.305: MUX_2.10 46.99,57.47 47.31,57.15 48.58,57.15 49.85,55.88 49.85,50.48 46.99,47.62 MUX_1.10 46.99,44.13 v47.31,43.81
  Bottom 0.305: v47.31,43.81 47.31,42.23 36.83,31.75 36.83,25.08 34.92,23.18 30.48,23.18 30.16,23.5 JP7.1
MAT2  (via drill 0.6)
  Top 0.254: IC1.13 27.5,23.5 28,24 28,27.25 28.25,27.5 30,27.5 30.16,27.66 | 30.16,27.66 30.25,27.75 | 30.16,27.66 JP7.2
  Top 0.305: MUX_2.9 48.26,58.42 50.48,56.2 50.48,49.85 48.26,47.62 48.26,46.04 48.16,45.94 | 48.16,45.94 MUX_1.9 | 48.16,45.94 48.26,45.83 48.26,44.45 v48.84,43.87
  Bottom 0.305: JP7.2 28.57,27.62 27.94,26.99 27.94,23.18 28.57,22.54 50.16,22.54 50.8,23.18 50.8,36.83 49.21,38.42 49.21,42.66 48.88,43 48.88,43.75 48.75,43.87 | 48.75,43.87 48.75,43.88 | 48.75,43.87 v48.84,43.87
MAT3
  Top 0.254: 30.25,30.25 JP7.3 27.66,30.16 26,28.5 25.38,28.5 24.62,27.75 24.62,26 23.88,25.25 23.88,24.25 24.12,24 25.38,24 | 25.38,24 | IC1.14 25.38,24
  Top 0.305: MUX_1.6 45.72,38.73 45.09,38.1 43.5,38.1 39.05,33.66 31.75,33.66 31.11,33.02 | 31.11,33.02 30.16,32.07 JP7.3 | DELAY_1.1 20.95,39.27 20.95,38.1 25.08,34.61 29.21,34.61 30.8,33.02 31.11,33.02
N$1
  Top 0.305: C8.1 48.19,30.87 48.26,30.8 48.17,30.71 R7.2 | C9.1 45.72,32.7 | C9.1 | R7.2 | R7.2 C9.1
N$2
  Top 0.254: IC1.62 22.5,13.12 25,10.62 25,8 25.24,7.76 | 25.24,7.76 25.25,7.75 | 25.24,7.76 Q1.2 26.99,7.76 27.5,7.25 29.38,7.25 29.68,6.94 | 29.68,6.94 29.75,6.88 | 29.68,6.94 C7.1
N$3
  Top 0.254: IC1.61 22,12.62 20.5,11.12 20.5,7.88 20.38,7.75 20.36,7.76 Q1.1 18.14,7.76 17.88,7.5 16,7.5 15.75,7.25 15.77,7.23 C6.1
N$4
  Top 0.254: PWR1.C 27.75,32.24 26.88,31.38 25.75,31.38 25.75,31.37 R10.2
N$5  (via drill 0.6)
  Top 0.254: IC1.47 13,18 12.75,17.75 12.75,15.62 v12.5,15.38
  Bottom 0.254: v12.5,15.38 9.25,15.38 8.62,16 8.62,24.12 5.38,27.38 | 2.88,27.38 3,27.5 JP1.6
  Bottom 0.406: 5.38,27.38 2.88,27.38
N$6  (via drill 0.6)
  Top 0.254: IC1.22 21,28.62 20.5,29.12 v20.5,30.88 | v14.62,35 14.12,35 10.88,38.25 7.5,38.25 5.62,40.12 | 2.88,40.12 2.96,40.21 JP1.1
  Top 0.406: 2.88,40.12 5.62,40.12
  Bottom 0.254: v20.5,30.88 19.75,31.62 17.5,31.62 15.25,33.88 15.25,34.38 v14.62,35
N$7
  Top 0.305: JP6.2 46.45,34.19 46.99,33.66 47.62,33.66 47.94,33.34 47.94,32.47 | 47.94,32.47 47.94,32.38 | C8.2 47.94,32.47
N$8  (via drill 0.6)
  Top 0.305: DELAY_1.4 20.95,43.18 20.85,43.28 DELAY_1.5 | DELAY_1.4 22.23,43.18 24.45,40.96 26.04,40.96 26.03,40.95 1A.P$6 | C26.2 11.75,42.23 v12.06,41.91 | v19.05,43.18 DELAY_1.4
  Bottom 0.305: v12.06,41.91 17.78,41.91 v19.05,43.18
N$9
  Top 0.254: IC1.26 19,29.25 10.5,37.75 5.25,37.75 | 2.75,37.75 2.83,37.67 JP1.2
  Top 0.406: 2.75,37.75 5.25,37.75
N$10
  Top 0.254: IC1.27 18.5,28.88 12.25,35.12 5.38,35.12 | 2.88,35.12 2.88,35.13 JP1.3
  Top 0.406: 2.88,35.12 5.38,35.12
N$11
  Top 0.406: IC3.1 41.92,16.8 41.5,16.38 41.5,14.75 41.43,14.82 R18.1 40.46,14.84 40,14.38 39.62,14.38 39.5,14.5 39.5,15.5 39.49,15.51 R19.2
N$12
  Top 0.254: IC1.29 17.5,29 13.88,32.62 5.38,32.62 | JP1.4 3,32.74 3,32.75 3.12,32.62
  Top 0.406: 3.12,32.62 5.38,32.62
N$13
  Top 0.254: IC1.30 17,28.62 16,29.62 6.75,29.62 6.38,30 | 3,30.13 2.88,30.25 | JP1.5 3,30.13 | 3,30.13 3.12,30
  Top 0.406: 3.12,30 6.38,30
N$15
  Top 0.254: 2.88,25 2.9,24.97 JP1.7 | 5.25,25 | 5.25,25 IC1.33 | 2.88,25
  Top 0.406: 2.88,25 5.25,25
N$16
  Top 0.254: IC1.34 8.12,24.5 6.12,22.5 | 2.88,22.5 2.94,22.43 JP1.8
  Top 0.406: 2.88,22.5 6.12,22.5
N$17
  Top 0.254: IC1.35 10,24 5.88,19.88 5.5,19.88 | 3.12,19.88 3.11,19.89 JP1.9
  Top 0.406: 3.12,19.88 5.5,19.88
N$18
  Top 0.254: IC1.37 10,23 6.38,19.38 6.38,18 5.88,17.5 | JP1.10 3,17.13 3,17.12 3.38,17.5
  Top 0.406: 3.38,17.5 5.88,17.5
N$19
  Top 0.254: IC1.38 10.5,22.5 7.25,19.25 7.25,16.12 6,14.88 | 3,14.88 3,14.87 JP1.11
  Top 0.406: 3,14.88 6,14.88
N$20
  Top 0.254: IC1.39 11,22 7.88,18.88 7.88,14.25 5.88,12.25 | 3.12,12.25 3.1,12.27 JP1.12
  Top 0.406: 3.12,12.25 5.88,12.25
N$21
  Top 0.254: 5.39,9.73 5.5,9.62 8.75,9.62 9.62,10.5 9.62,15.12 11.62,17.12 11.62,18.12 12.5,19 13.88,19 | 13.88,19 | 13.88,19 IC1.45
  Top 0.406: JP1.13 5.39,9.73
N$22
  Top 0.254: IC1.46 12.75,18.5 12.12,17.88 12.12,16.75 10.12,14.75 10.12,10.25 9,9.12 6.12,9.12 5.62,8.62 5.62,7.62 5.25,7.25 | 3,7.25 JP1.14
  Top 0.406: 3,7.25 5.25,7.25
N$23  (via drill 0.6)
  Top 0.254: IC1.53 18,13.75 18.25,13.5 v18.25,12.88 18.12,12.88
  Bottom 0.254: v18.25,12.88 18.25,12.12 12.5,6.38 6.5,6.38 5,4.88 | JP1.15 3,4.38 3.38,4.88
  Bottom 0.406: 3.38,4.88 5,4.88
N$24
  Top 0.254: R17.1 39.69,22.2 39.69,23.18 39.37,23.5 37.78,23.5 37.78,23.08 PWR.A
N$25  (via drill 0.6)
  Top 0.254: v19.5,12.25 19.5,13 18.5,14 18.5,15.62 | 18.5,15.62 | 18.5,15.62 IC1.54
  Bottom 0.254: 4.86,2.11 5.25,2.5 5.25,4.12 6.88,5.75 12.75,5.75 v19.5,12.25
  Bottom 0.406: JP1.16 4.86,2.11
N$31
  Top 0.305: 1A.P$4 25.72,42.22 25.72,42.23 24.45,42.23 22.86,43.81 22.86,45.09 22.23,45.72 DELAY_1.6 18.73,45.72 18.1,45.09 18.1,41.59 17.14,40.64 DELAY_1.13 14.61,40.64 | 14.61,40.64 14.29,40.64 | C25.2 12.51,40.7 12.7,40.64 14.61,40.64
N$32
  Top 0.305: 1A.P$2 24.45,43.49 23.5,44.45 23.5,46.67 21.91,48.26 18.41,48.26 17.14,46.99 17.14,43.81 16.51,43.18 DELAY_1.11 | DELAY_1.12 14.61,41.91 14.71,42.01 DELAY_1.11 | C24.2 11.75,44.13 12.7,43.18 DELAY_1.11
N$33  (via drill 0.6)
  Top 0.305: DELAY_1.10 14.61,44.45 14.71,44.55 DELAY_1.9 | C23.2 12.06,46.04 12.38,45.72 DELAY_1.9 | DELAY_1.9 16.19,45.72 16.51,46.04 16.51,47.31 v18.73,49.53 | v26.35,53.34 26.35,54.93 26.04,55.24 26.04,56.52 25.72,56.83 | 25.72,56.83 | 25.72,56.83 2A.P$8
  Bottom 0.305: v18.73,49.53 22.54,49.53 v26.35,53.34
N$34  (via drill 0.6)
  Top 0.305: DELAY_2.1 23.5,54.29 23.97,54.77 | 23.97,54.77 24.45,55.24 24.45,57.78 24.77,58.1 26.04,58.1 26.03,58.1 2A.P$6 | C22.2 12.38,52.07 v12.7,52.39 | 23.97,54.77 | v24.45,53.34 24.45,54.29 23.97,54.77 | DELAY_1.8 v12.7,46.99
  Bottom 0.305: 16.51,52.39 v12.7,52.39 | 16.51,52.39 23.5,52.39 v24.45,53.34 | v12.7,46.99 12.7,49.21 13.02,49.53 15.88,49.53 16.51,50.16 16.51,52.39
N$35  (via drill 0.6)
  Top 0.305: DELAY_2.2 20.85,56.73 20.95,56.83 DELAY_2.3 22.23,56.83 | 22.23,56.83 24.77,59.37 25.72,59.37 2A.P$4 | C21.2 v12.06,53.98 | v23.18,55.56 23.18,55.88 22.23,56.83
  Bottom 0.305: v12.06,53.98 21.59,53.98 v23.18,55.56
N$36  (via drill 0.6)
  Top 0.305: 20.95,59.37 DELAY_2.5 | DELAY_2.4 20.85,59.27 20.95,59.37 | 20.95,59.37 23.5,59.37 24.45,60.64 | 2A.P$2 25.72,60.64 24.45,60.64 | C20.2 v12.06,55.88 | v24.45,61.91 24.45,60.64
  Bottom 0.305: v12.06,55.88 13.02,55.88 19.05,61.91 v24.45,61.91
N$37  (via drill 0.6)
  Top 0.305: 14.92,55.56 16.19,55.56 v16.83,54.93 16.51,54.61 16.51,53.02 18.73,50.8 20.64,50.8 23.5,47.94 26.04,47.94 26.03,47.94 3A.P$8 | C17.2 12.06,57.78 13.02,56.83 13.02,56.2 13.65,55.56 14.92,55.56 | DELAY_2.13 14.92,55.56 | v22.86,60.64 DELAY_2.6
  Bottom 0.305: v22.86,60.64 22.86,59.37 19.68,56.2 18.1,56.2 v16.83,54.93
N$38
  Top 0.305: 3A.P$6 25.72,49.21 23.81,49.21 21.59,51.44 19.37,51.44 17.78,53.02 17.78,56.2 17.14,56.83 DELAY_2.12 14.61,56.83 14.71,56.93 DELAY_2.11 13.34,58.1 13.02,58.42 13.02,59.37 12.7,59.69 C16.2
N$39
  Top 0.305: 3A.P$4 26.03,50.48 26.04,50.48 23.81,50.48 22.23,52.07 19.68,52.07 18.41,53.34 18.41,58.42 17.46,59.37 DELAY_2.10 14.61,59.37 14.71,59.47 DELAY_2.9 12.7,60.64 11.75,61.59 C15.2
N$40
  Top 0.305: DELAY_2.8 16.83,61.91 19.05,59.69 19.05,53.66 20,52.7 22.86,52.7 23.81,51.75 25.72,51.75 3A.P$2
N$41  (via drill 0.6)
  Top 0.305: 1A.P$1 v30.48,43.5 1B.P$2 | v39.05,37.47 39.37,37.78 MUX_1.1
  Bottom 0.305: v30.48,43.5 30.8,43.81 30.8,44.77 30.48,45.09 27.62,45.09 27.3,44.77 27.3,38.73 27.94,38.1 38.1,38.1 38.73,37.47 v39.05,37.47
N$42  (via drill 0.6)
  Top 0.254: v30.48,42.22 v30.48,42.23 | MUX_1.5 44.45,39.69 | 32.38,42.23 32.38,42.22 1B.P$4
  Top 0.305: 1A.P$3 v30.48,42.22 | v44.58,42.11 44.38,41.38 MUX_1.5 | v30.48,42.23 32.38,42.23
  Bottom 0.305: v30.48,42.23 33.34,42.23 34.61,40.96 36.83,40.96 38.42,42.55 39.69,42.55 40.01,42.86 43.88,42.88 v44.58,42.11
N$43  (via drill 0.6)
  Top 0.254: v30.48,40.95 v30.48,40.96 | MUX_1.2 40.64,39.69 | 32.38,40.96 32.38,40.95 1B.P$6
  Top 0.305: 1A.P$5 v30.48,40.95 | v40.64,41.91 MUX_1.2 | v30.48,40.96 32.38,40.96
  Bottom 0.305: v30.48,40.96 33.34,40.96 33.97,40.32 37.15,40.32 38.73,41.91 v40.64,41.91
N$44  (via drill 0.6)
  Top 0.254: v30.48,39.68 v30.48,39.69 | MUX_1.4 43.18,39.69 | 32.38,39.69 32.38,39.68 1B.P$8
  Top 0.305: 1A.P$7 v30.48,39.68 | v43.18,41.91 MUX_1.4 | v30.48,39.69 32.38,39.69
  Bottom 0.305: v30.48,39.69 40.32,39.69 42.55,41.91 v43.18,41.91
N$45
  Top 0.305: 2A.P$1 2B.P$2 | 2B.P$2 32.38,60.64 | 2B.P$2 32.26,62.1 32.7,62.55 42.86,62.55 43.18,62.23 MUX_2.13
N$46  (via drill 0.6)
  Top 0.305: 2A.P$3 v30.48,59.37 32.38,59.37 2B.P$4 | 41.91,60.64 MUX_2.14 v41.91,57.78
  Bottom 0.305: v30.48,59.37 39.05,59.37 40.64,57.78 v41.91,57.78
N$47  (via drill 0.6)
  Top 0.305: 2A.P$5 v30.48,58.1 32.38,58.1 2B.P$6 | 40.64,60.64 MUX_2.15 v40.64,56.83
  Bottom 0.305: v30.48,58.1 38.42,58.1 39.69,56.83 v40.64,56.83
N$48  (via drill 0.6)
  Top 0.305: 2A.P$7 v30.48,56.83 32.38,56.83 2B.P$8 | 44.45,60.64 MUX_2.12 v44.45,57.15
  Bottom 0.305: v30.48,56.83 37.78,56.83 38.73,55.88 43.18,55.88 v44.45,57.15
N$49  (via drill 0.6)
  Top 0.305: 3A.P$1 v30.48,51.75 32.07,51.75 3B.P$2 | 39.37,54.61 MUX_2.1 38.52,54.39 38.1,53.98 v38.1,53.34
  Bottom 0.305: v30.48,51.75 36.51,51.75 v38.1,53.34
N$50  (via drill 0.6)
  Top 0.305: 3A.P$3 v30.48,50.48 32.07,50.48 3B.P$4 | 44.45,54.61 MUX_2.5 v44.45,52.39
  Bottom 0.305: v30.48,50.48 42.55,50.48 v44.45,52.39
N$51  (via drill 0.6)  (1 unrouted)
  Top 0.305: v41.91,52.39 MUX_2.3 | C27.1 50.16,48.26 51.44,49.53 51.44,51.12 51.75,51.44 53.02,51.44 U$6.SIG | C27.1 49.85,47.31 | MUX_1.3 41.91,42.03 43,43.12 45.88,43.12 46.75,42.25 49.75,42.25 50,42.5 50,44.25 49.12,45.12 49.12,47.38 49.25,47.5 50.12,47.5 50.15,47.52 C27.1
  Bottom 0.305: v41.91,52.39 42.86,52.39 43.81,53.34 45.72,53.34 46.35,52.7 46.35,52.07 47.31,51.12 52.7,51.12 53.28,51.69
N$52  (via drill 0.6)
  Top 0.305: 3A.P$7 v30.48,47.94 32.38,47.94 3B.P$8 | v38.42,49.21 38.42,50.8 38.73,51.12 42.23,51.12 43.18,52.07 MUX_2.4
  Bottom 0.305: v30.48,47.94 36.83,47.94 v38.42,49.21
N$53  (via drill 0.6)
  Top 0.305: v45.72,51.12 MUX_2.6 | v24.45,37.78 23.81,37.78 23.18,38.42 23.18,39.69 22.23,40.64 DELAY_1.2 20.64,40.64
  Bottom 0.305: v45.72,51.12 44.13,49.53 42.55,49.53 40.01,46.99 26.67,46.99 25.08,45.4 25.08,38.42 v24.45,37.78
N$55  (via drill 0.6)
  Top 0.305: MUX_1.15 40.64,44.45 40.32,44.13 36.83,44.13 36.51,43.81 36.51,36.83 | 36.51,36.83 36.51,36.2 36.2,35.88 34.29,35.86 R3.1 | R4.1 32.02,32.53 v31.88,32.38 | v35.56,36.83 36.51,36.83
  Bottom 0.305: v31.88,32.38 31.88,32.07 32.32,31.75 34.61,31.75 35.24,32.38 35.24,36.51 v35.56,36.83
N$56
  Top 0.305: MUX_1.12 44.45,44.45 44.12,44.12 43.12,44.12 41.86,42.86 38.42,42.86 37.78,42.23 37.78,35.56 36.51,34.29 31.11,34.29 30.16,35.24 30.16,36.13 | 30.16,36.13 30.16,36.2 | 30.16,36.13 R2.1
N$57
  Top 0.305: MUX_1.14 41.91,43.81 41.59,43.5 37.47,43.5 37.15,43.18 37.15,35.88 36.2,34.92 33.02,34.92 32.38,35.56 32.38,36.15 | 32.38,36.15 32.38,36.2 | R1.1 32.38,36.15
RAW
  Top 0.813: JP3.1 53.98,20.54 53.98,18.41 58.74,13.65 58.74,9.18 56.41,6.85 51.57,6.85 | 47.68,4.45 47.62,4.45 | D1.1 47.68,4.45 | 51.57,6.85 49.41,4.45 47.68,4.45 | U$1.P$1 47.77,10.65 51.57,6.85
RST  (via drill 0.6)
  Top 0.254: IC1.57 20,14.5 20.12,14.38 20.38,14.12 v20.38,13.38 | v8.12,12.75 8,12.75 7.25,12 7.25,10.75 7.24,10.77 S1.P$1 | v14.12,14.75 13.75,14.38 11.75,14.38 11.55,14.18 R9.1 11.55,12.2 11.75,12 12.25,12 12.5,11.75 12.5,10.88 12.38,10.75 S1.P$4
  Bottom 0.254: 14.5,13.62 9,13.62 v8.12,12.75 | 14.5,13.62 17.38,13.62 17.62,13.88 19.12,13.88 19.62,13.38 v20.38,13.38 | 14.5,13.62 14.5,14.38 v14.12,14.75 14,14.75 14.12,14.88 14.12,15.88 13.25,16.75 12.25,16.75 10.88,18.12 10.88,20.5 11.75,21.38 11.75,28.12 6.62,33.25 6.62,53.25 5.52,54.35
  Bottom 0.406: 5.52,54.35 JP2.2
RXD0  (via drill 0.6)
  Top 0.254: IC1.21 21.5,28.88 21.12,29.25 21.12,30.12 v22,30.88 | v18,32.62 15.75,34.88 15.75,35.25 14.88,36.12 14.5,36.12 11.75,38.88 8.12,38.88 5.62,41.38 5.62,46.12 5.12,46.62 | 2.89,46.73 2.88,46.75 | 2.89,46.73 JP2.5 | 3,46.62 2.89,46.73
  Top 0.406: 5.12,46.62 3,46.62
  Bottom 0.254: v22,30.88 21.5,31.38 20.25,32.62 v18,32.62
SOUND
  Top 0.305: JP6.1 48.9,35.56 49.85,33.97 49.85,31.11 50.48,30.48 53.34,30.48 53.38,30.45 U$5.SIG
TXD0  (via drill 0.6)
  Top 0.254: IC1.19 22.5,29 22.12,29.38 v22.12,29.62 | v17,35 15,37 14.62,37 12.25,39.38 8.5,39.38 7.12,40.75 7.12,47.62 5.38,49.38 | 3.04,49.17 3,49.12 | 3.04,49.17 JP2.4 | 3.25,49.38 3.04,49.17
  Top 0.406: 5.38,49.38 3.25,49.38
  Bottom 0.254: v22.12,29.62 23,30.5 23,31.38 20.38,34 18,34 v17,35
VCC  (via drill 0.6, 0.7)
  Top 0.254: 44.13,18.62 44.13,20.64 43.5,21.27 41.59,21.27 40.96,20.64 39.69,20.64 39.69,20.5 R17.2 | 20.45,32.07 20.62,31.88 | C3.1 20.45,32.07 | 19.5,32.12 20.5,32.12 20.45,32.07 | 19.5,32.12 | 19.5,32.12 19.5,29.25 20.5,28.25 | 20.5,28.25 20.5,28 | 20.5,28 | 20.5,28.25 20.5,28 | 20.5,28.25 IC1.23 | IC1.7 29.5,20.5 29.62,20.62 30.12,20.62 30.38,20.88 C5.1 | C2.1 26.73,11.85 26.75,11.88 v26.75,13.5 23.5,13.5 23,14 IC1.63 23,15.75 | 16,15.62 | 16,15.62 IC1.49 16,13.88 15.75,13.62 14.75,13.62 14.38,13.25 13.12,13.25 13.18,13.2 R9.2 | 16,15.62 16,19.62 15.62,20 IC1.43 12.38,20 v12,20 12,19.25 11,18.25 11,17.5 10.61,17.11 C1.1 | C4.1 17.12,11.62 17.25,11.75 17.25,12.62 17,13 IC1.51 17,17.25 17.38,17.62 21.25,17.62 21.62,17.25 22.75,17.25 23,17 23,15.75 | 23,15.75
  Top 0.305: 34.93,59.37 34.92,59.37 35.05,59.5 2B.P$1 | 34.93,59.37 2B.P$3 | 34.93,59.37 34.93,58.11 34.92,58.1 34.93,58.1 2B.P$5 35.05,56.96 34.92,56.83 34.93,56.83 2B.P$7 35.88,56.83 36.51,56.2 C14.1 34.82,55.14 34.29,54.61 34.29,53.02 34.92,52.39 34.92,51.75 34.93,51.75 3B.P$1 3B.P$3 | 3B.P$3 35.05,50.35 35.24,50.16 | 3B.P$3 35.05,49.34 34.92,49.21 34.93,49.21 3B.P$5 35.05,48.07 34.92,47.94 34.93,47.94 3B.P$7 37.47,47.94 37.78,47.62 37.78,46.99 C12.1 35.77,46.89 35.24,46.35 35.24,43.5 35.24,43.49 1B.P$1 35.05,42.41 35.24,42.23 35.24,42.22 1B.P$3 35.05,41.09 34.92,40.96 34.93,40.95 1B.P$5 35.05,39.82 34.92,39.69 34.93,39.68 | 34.93,39.68 1B.P$7 | C10.1 15.34,52.6 15.24,52.7 | DELAY_2.14 14.61,54.29 14.92,53.98 14.92,53.02 15.24,52.7 | 15.24,52.7 15.24,51.12 v14.29,51.12 | 3.04,56.96 2.86,57.15 | JP2.1 3.04,56.96 | 3.04,56.96 3.33,56.68 | DELAY_1.14 14.71,38.31 15.24,37.77 16.85,37.77 18.5,36.12 | C3.1 20.56,32.2 20.64,32.12 19.5,32.12 19.5,32.62 18.62,33.5 C13.1 18.55,34.92 18.5,34.88 18.5,36.12 | 34.06,37.78 33.97,37.78 33.97,38.1 34.92,39.05 34.92,39.68 34.93,39.68 | 32.3,37.78 32.07,37.78 | 34.06,37.78 R3.2 | 32.3,37.78 34.06,37.78 | 30.21,37.78 R2.2 | 32.3,37.78 R1.2 | 30.21,37.78 32.3,37.78 | PWR1.A 24.1,33.34 22.86,33.34 22.23,33.97 | v22.23,34.29 22.23,33.97 | 30.21,37.78 28.26,37.78 v26.67,36.2 | 22.23,33.97 22.23,35.15 | 22.23,33.97 22.23,35.77 21.88,36.12 18.5,36.12
  Top 0.406: 35.56,13.97 C18.1 35.56,15.61 35.56,17.46 32.38,20.64 30.8,20.64 30.8,20.55 C5.1 | JP5.1 30,2.5 28.75,2.5 JP5.2 27.5,2.5 26.25,2.5 JP5.3 25,2.5 23.75,2.5 JP5.4 | MUX_1.16 39.37,46.04 39.36,46.03 38.73,46.03 37.78,46.99 37.88,47.2 C12.1 | MUX_2.16 39.05,60.75 35.75,60.75 2B.P$1 | 3.33,56.68 R8.1
  Top 0.61: 31.21,1.91 34.61,1.91 36.2,3.49 36.2,7.3 39.05,10.16 39.05,11.7 | IC3.2 44.13,18.62 44.13,16.83 43.18,15.88 43.18,14.88 R18.2 43.18,14.79 43.18,13.97 40.96,11.75 39.05,11.75 39.05,13.02 38.42,13.65 37.22,13.65 | 37.22,13.65 35.88,13.65 35.56,13.97 | 37.22,13.65 v37.22,14.94
  Top 0.813: JP5.1 31.21,1.91 | 39.05,11.75 39.05,11.7 C19.A
  Bottom 0.254: 12.62,36.2 12.62,35.88 12.38,35.62 12.38,21.12 12,20.75 v12,20 | 29.88,14.94 29.88,14.88 29.12,15.88 v26.75,13.5
  Bottom 0.305: 10.79,51.12 v14.29,51.12 | 22.23,36.2 v22.23,34.29 | 25.56,35.08 | 25.56,35.08 v26.67,36.2
  Bottom 0.61: v37.22,14.94 29.88,14.94 29.82,14.94 26.99,17.78 26.99,33.66 25.56,35.08 24.45,36.2 22.23,36.2 12.62,36.2 12.06,36.2 10.79,37.47 10.79,51.12 5.02,56.89 JP2.1
VIN
  Top 0.813: IC3.3 46.55,15.11 42.55,11.11 42.55,9.84 38.07,5.37 | C11.+ 38.07,5.37 | D1.2 43.28,4.45 39,4.45 38.07,5.37
(copper drawn outside any net)
  shapes: Top area x1

### Text on the board
tPlace: www.cigarsynth.com | 0.2 | 0.3 | 0.4 | video | 0.5 | stat | 0.6 | critter | 0.17 | 0.8 | pwr | 0.9 | 0.10 | GND | Vin | 0.11 | 0.12 | 0.13 | RST | v01 | 0.15 | 0.16 | 0.18 | Vcc | 9VDC | GND | 0.19